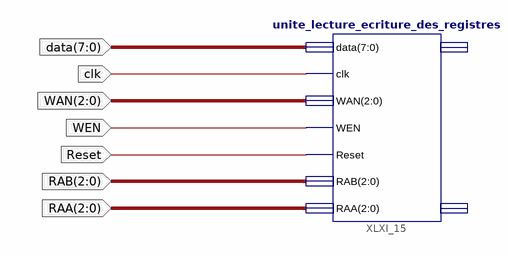
[diagram p0: schematic sheet 1]
// Xilinx ISE schematic toplevel.sch (spartan3e) as structural Verilog: 1 symbols, 7 ports
module toplevel (
  input  [7:0] data,
  input  clk,
  input  [2:0] WAN,
  input  WEN,
  input  Reset,
  input  [2:0] RAB,
  input  [2:0] RAA
);

  unite_lecture_ecriture_des_registres XLXI_15 (
    .data(data), .clk(clk), .WAN(WAN), .WEN(WEN), .Reset(Reset), .RAB(RAB), .RAA(RAA));  // open: B, A
endmodule
